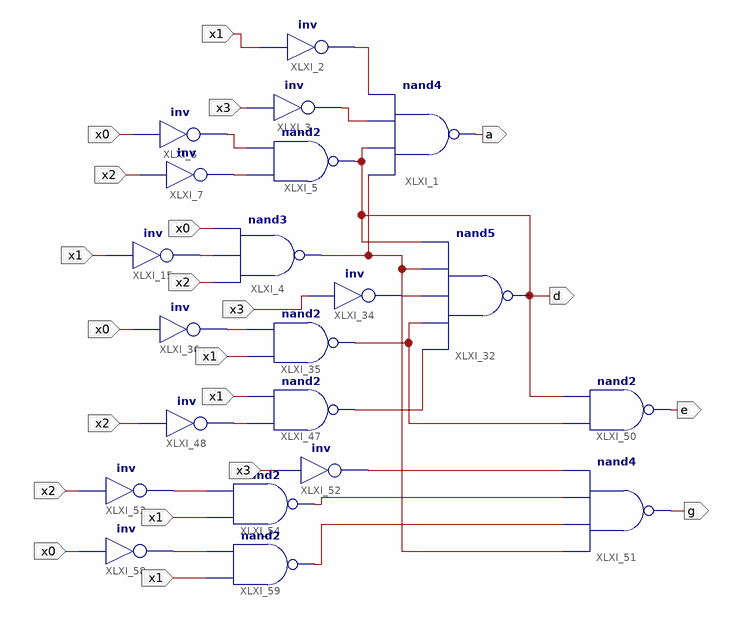
[diagram p0: schematic sheet 1]
// Xilinx ISE schematic schematic.sch (spartan6) as structural Verilog: 21 symbols, 8 ports
module schematic (
  input  x1,
  input  x3,
  input  x0,
  input  x2,
  output a,
  output d,
  output e,
  output g
);

  wire XLXN_2, XLXN_3, XLXN_9, XLXN_16, XLXN_17, XLXN_50, XLXN_98, XLXN_100, XLXN_104, XLXN_112, XLXN_119,
       XLXN_122, XLXN_135, XLXN_144, XLXN_145, XLXN_148;

  not XLXI_3 (XLXN_3, x3);
  not XLXI_2 (XLXN_9, x1);
  nand XLXI_1 (a, XLXN_2, d, XLXN_3, XLXN_9);
  not XLXI_6 (XLXN_16, x0);
  nand XLXI_5 (d, XLXN_17, XLXN_16);
  not XLXI_7 (XLXN_17, x2);
  nand XLXI_4 (XLXN_2, x2, XLXN_50, x0);
  nand XLXI_32 (d, XLXN_122, XLXN_112, XLXN_98, XLXN_2, d);
  not XLXI_15 (XLXN_50, x1);
  not XLXI_34 (XLXN_98, x3);
  not XLXI_36 (XLXN_100, x0);
  nand XLXI_35 (XLXN_112, x1, XLXN_100);
  nand XLXI_47 (XLXN_122, XLXN_119, x1);
  not XLXI_48 (XLXN_119, x2);
  nand XLXI_50 (e, XLXN_112, d);
  nand XLXI_51 (g, XLXN_2, XLXN_148, XLXN_144, XLXN_135);
  not XLXI_52 (XLXN_135, x3);
  nand XLXI_54 (XLXN_144, x1, XLXN_104);
  not XLXI_53 (XLXN_104, x2);
  nand XLXI_59 (XLXN_148, x1, XLXN_145);
  not XLXI_58 (XLXN_145, x0);
endmodule
